# Altium schematic sheet ethernet.SchDoc: MCB | ethernet
size A4; DocumentNumber: 5; SheetNumber: 5; SheetTotal: 12
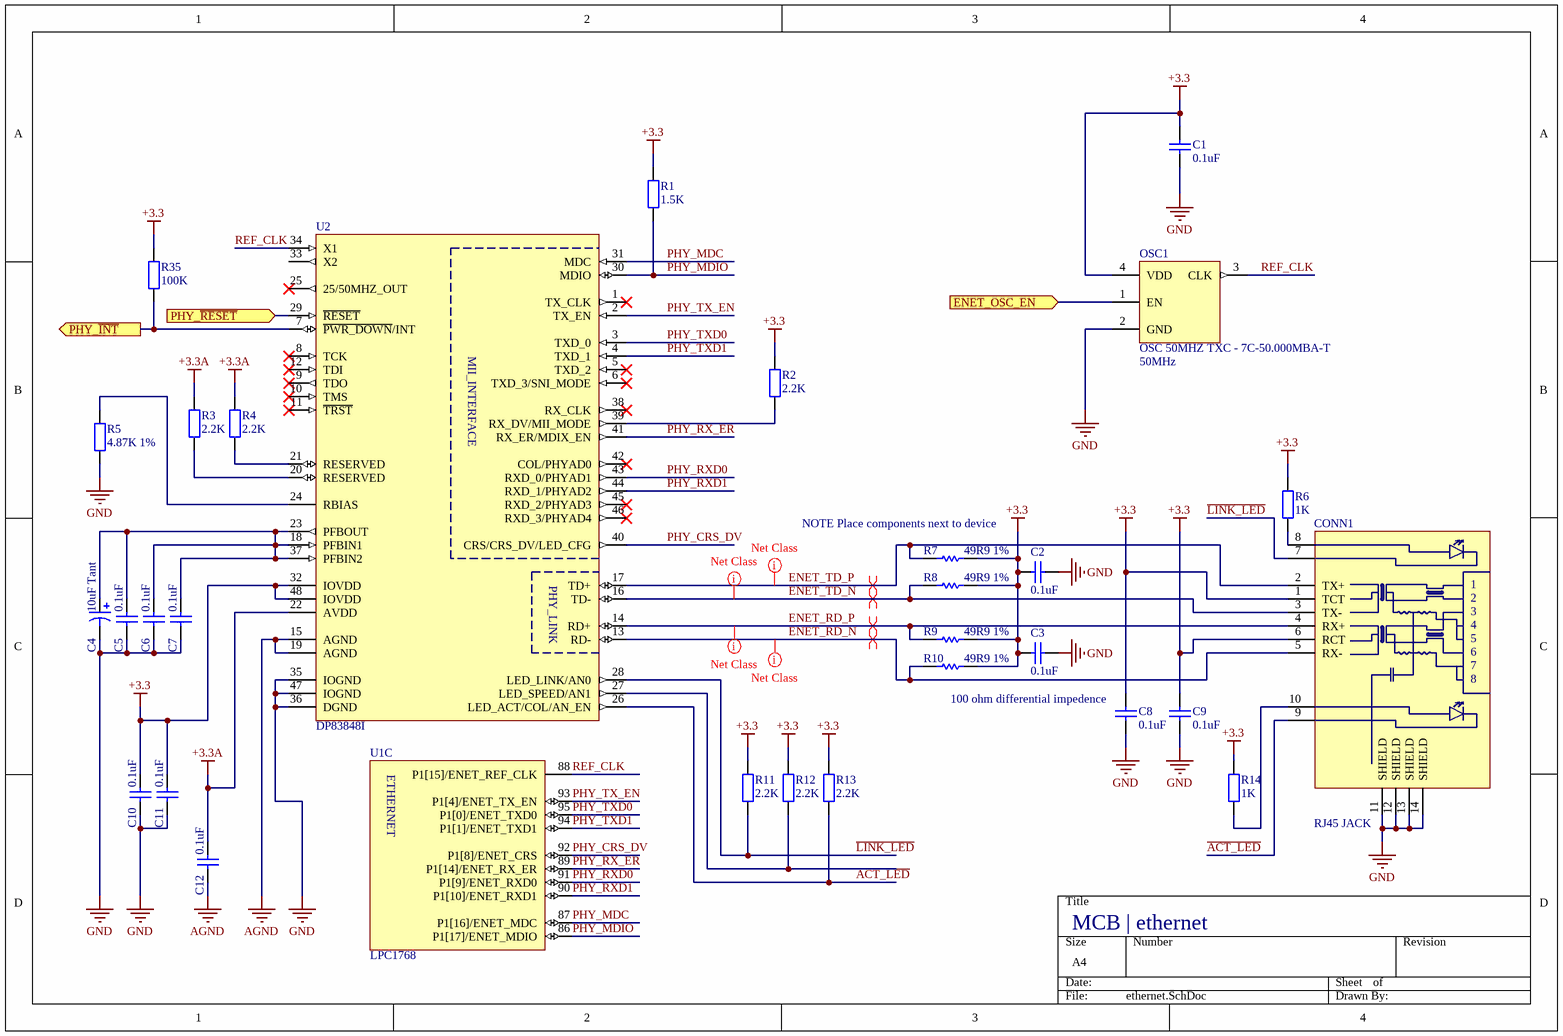
[diagram p0: ethernet.SchDoc]

## Parts
C1  value 0.1uF  [C0603]  (hidden comment: Cap)
C2  value 0.1uF  [C0603]  (hidden comment: Cap)
C3  value 0.1uF  [C0603]  (hidden comment: Cap)
C4  value 10uF Tant  [T491C106K035AT]  (hidden comment: Cap Pol1)
C5  value 0.1uF  [C0603]  (hidden comment: Cap)
C6  value 0.1uF  [C0603]  (hidden comment: Cap)
C7  value 0.1uF  [C0603]  (hidden comment: Cap)
C8  value 0.1uF  [C0603]  (hidden comment: Cap)
C9  value 0.1uF  [C0603]  (hidden comment: Cap)
C10  value 0.1uF  [C0603]  (hidden comment: Cap)
C11  value 0.1uF  [C0603]  (hidden comment: Cap)
C12  value 0.1uF  [C0603]  (hidden comment: Cap)
CONN1  RJ45 JACK  [RJMG163118101NR]
OSC1  OSC 50MHZ TXC - 7C-50.000MBA-T  value 50MHz  [7C-50.000MBA-T]
R1  value 1.5K  [R0603]  (hidden comment: Res)
R2  value 2.2K  [R0603]  (hidden comment: Res)
R3  value 2.2K  [R0603]  (hidden comment: Res)
R4  value 2.2K  [R0603]  (hidden comment: Res)
R5  value 4.87K 1%  [R0603]  (hidden comment: Res)
R6  value 1K  [R0603]  (hidden comment: Res)
R7  value 49R9 1%  [R0603]  (hidden comment: Res)
R8  value 49R9 1%  [R0603]  (hidden comment: Res)
R9  value 49R9 1%  [R0603]  (hidden comment: Res)
R10  value 49R9 1%  [R0603]  (hidden comment: Res)
R11  value 2.2K  [R0603]  (hidden comment: Res)
R12  value 2.2K  [R0603]  (hidden comment: Res)
R13  value 2.2K  [R0603]  (hidden comment: Res)
R14  value 1K  [R0603]  (hidden comment: Res)
R35  value 100K  [R0603]  (hidden comment: Res)
U1  LPC1768  [LPC1768]  (part C of 3)
U2  DP83848I  [DP83848IVV]

## Ports
ENET_OSC_EN (in), PHY_~{INT} (out), PHY_~{RESET} (in)

## Nets
+3.3: C1.2 C2.1 C3.1 C8.2 C9.2 C10.1 C11.1 CONN1.1(TCT) CONN1.6(RCT) OSC1.4(VDD) R1.2 R2.2 R6.2 R7.2 R8.2 R9.2 R10.2 R11.2 R12.2 R13.2 R14.2 R35.2 U2.32(IOVDD) U2.48(IOVDD)
+3.3A: C12.1 R3.2 R4.2 U2.22(AVDD)
AGND: C12.2 U2.15(AGND) U2.19(AGND)
GND: C1.1 C2.2 C3.2 C4.2 C5.2 C6.2 C7.2 C8.1 C9.1 C10.2 C11.2 CONN1.11(SHIELD) CONN1.12(SHIELD) CONN1.13(SHIELD) CONN1.14(SHIELD) OSC1.2(GND) R5.1 U2.35(IOGND) U2.36(DGND) U2.47(IOGND)
~{ACT_LED}: CONN1.9 R13.1 U2.26(LED_ACT/COL/AN_EN)
ENET_OSC_EN: OSC1.1(EN) ; port ENET_OSC_EN
ENET_RD_N: CONN1.5(RX-) R10.1 U2.13(RD-)
ENET_RD_P: CONN1.4(RX+) R9.1 U2.14(RD+)
ENET_TD_N: CONN1.3(TX-) R8.1 U2.16(TD-)
ENET_TD_P: CONN1.2(TX+) R7.1 U2.17(TD+)
~{LINK_LED}: CONN1.7 R11.1 U2.28(LED_LINK/AN0)
PHY_CRS_DV: U1.92(P1[8]/ENET_CRS) U2.40(CRS/CRS_DV/LED_CFG)
PHY_~{INT}: R35.1 U2.7(~{PWR_DOWN}/INT) ; port PHY_~{INT}
PHY_MDC: U1.87(P1[16]/ENET_MDC) U2.31(MDC)
PHY_MDIO: R1.1 U1.86(P1[17]/ENET_MDIO) U2.30(MDIO)
PHY_~{RESET}: U2.29(~{RESET}) ; port PHY_~{RESET}
PHY_RX_ER: U1.89(P1[14]/ENET_RX_ER) U2.41(RX_ER/MDIX_EN)
PHY_RXD0: U1.91(P1[9]/ENET_RXD0) U2.43(RXD_0/PHYAD1)
PHY_RXD1: U1.90(P1[10]/ENET_RXD1) U2.44(RXD_1/PHYAD2)
PHY_TX_EN: U1.93(P1[4]/ENET_TX_EN) U2.2(TX_EN)
PHY_TXD0: U1.95(P1[0]/ENET_TXD0) U2.3(TXD_0)
PHY_TXD1: U1.94(P1[1]/ENET_TXD1) U2.4(TXD_1)
REF_CLK: OSC1.3(CLK) U1.88(P1[15]/ENET_REF_CLK) U2.34(X1)
NetC4_1: C4.1 C5.1 C6.1 C7.1 U2.18(PFBIN1) U2.23(PFBOUT) U2.37(PFBIN2)
NetCONN1_8: CONN1.8 R6.1
NetCONN1_10: CONN1.10 R14.1
NetR2_1: R2.1 U2.39(RX_DV/MII_MODE)
NetR3_1: R3.1 U2.20(RESERVED)
NetR4_1: R4.1 U2.21(RESERVED)
NetR5_2: R5.2 U2.24(RBIAS)
NetR12_1: R12.1 U2.27(LED_SPEED/AN1)

Not connected (* = marked no-connect by the designer): U2 1(TX_CLK)* 5(TXD_2)* 6(TXD_3/SNI_MODE)* 8(TCK)* 9(TDO)* 10(TMS)* 11(~{TRST})* 12(TDI)* 25(25/50MHZ_OUT)* 33(X2) 38(RX_CLK)* 42(COL/PHYAD0)* 45(RXD_2/PHYAD3)* 46(RXD_3/PHYAD4)*

## Layout directives
differential pair: ENET_RD_N, ENET_RD_P, ENET_TD_N, ENET_TD_P
net class Ethernet: ENET_RD_N, ENET_RD_P, ENET_TD_N, ENET_TD_P

## Notes on the sheet
- NOTE Place components next to device
- (near C8) 100 ohm differential impedence
- (in symbol DP83848I) MII_INTERFACE; PHY_LINK
- (in symbol LPC1768, part C) ETHERNET

## Library data of the parts
C1-C3 C5-C12 = Cap: Capacitor; farnell: 1759122
C4 = Cap Pol1: Polarized Capacitor (Radial); Published: 8-Jun-2000; LatestRevisionDate: 17-Jul-2002; LatestRevisionNote: Re-released for DXP Platform.; PackageReference: RB7.6-15; Publisher: Altium Limited; farnell: 1457464
CONN1 = RJ45 JACK: 10/100 BASE T; farnell: 1357436
OSC1 = OSC 50MHZ TXC - 7C-50.000MBA-T: TXC - 7C-50.000MBA-T - OSC, 50.000MHZ, 3.3V, SMD, 5.0X3.2; farnell: 1842049
R1-R6 R11-R14 R35 = Res2: Resistor
  R1: farnell: 9330607
  R2-R4 R11-R13: farnell: 9330810
  R5: farnell: 1170858
  R6 R14: farnell: 9330380
  R35: farnell: 9330402
R7-R10 = Res1: Resistor; farnell: 1170658
U2 = DP83848I: 100mbit Ethernet PHY; farnell: 1286817